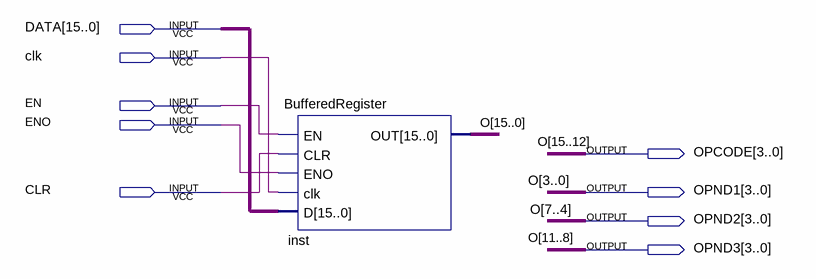
[diagram p0: schematic sheet]
// Quartus schematic InstructionRegister.bdf as structural Verilog: 1 symbols, 9 pins
module InstructionRegister (
  input  [15:0] DATA,
  input  clk,
  input  EN,
  input  ENO,
  input  CLR,
  output [3:0] OPCODE,
  output [3:0] OPND1,
  output [3:0] OPND2,
  output [3:0] OPND3
);

  BufferedRegister inst (.EN(EN), .CLR(CLR), .ENO(ENO), .clk(clk), .D(DATA), .OUT({OPCODE, OPND3, OPND2, OPND1}));

  // Other names for the same wires on the sheet: O[15:0] = {OPCODE, OPND3, OPND2, OPND1}
endmodule
